# EAGLE design final_2_connectors (EAGLE 7.7.0)
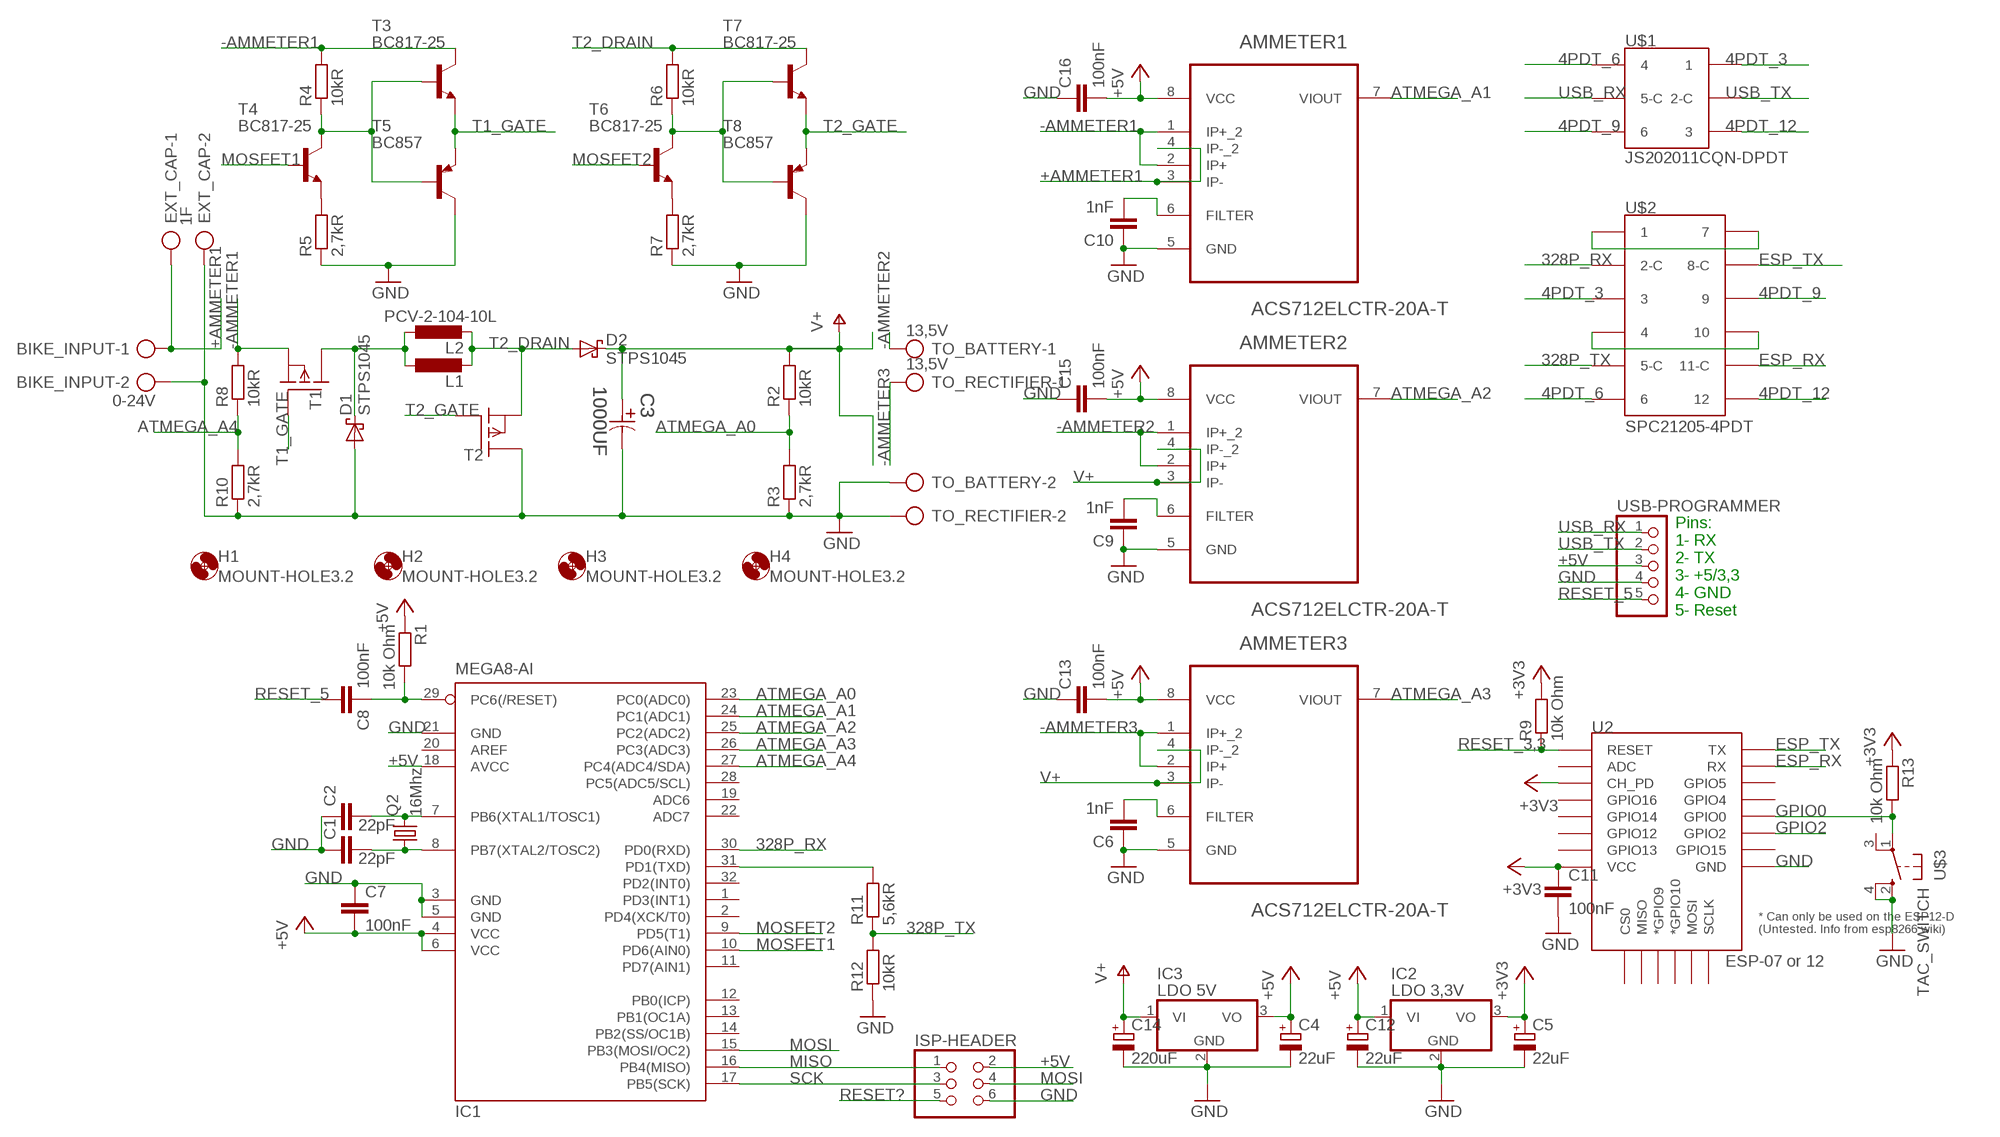
[diagram p0: schematic, sheet 1]

## Parts
AMMETER1  ACS712ELCTR-20A-T  [SOIC127P600X175-8N]
AMMETER2  ACS712ELCTR-20A-T  [SOIC127P600X175-8N]
AMMETER3  ACS712ELCTR-20A-T  [SOIC127P600X175-8N]
BIKE_INPUT  0-24V  AK500/2  [AK500/2]
C1  22pF  C-EUC0805  [C0805]
C2  22pF  C-EUC0805  [C0805]
C3  1000UF  EEV-FK1H102M-CASE-J16  [CAPAE1700X1700N]
C4  22uF  CPOL-EU153CLV-0505  [153CLV-0505]
C5  22uF  CPOL-EU153CLV-0505  [153CLV-0505]
C6  1nF  C-EUC0805  [C0805]
C7  100nF  C-EUC0805  [C0805]
C8  100nF  C-EUC0805  [C0805]
C9  1nF  C-EUC0805  [C0805]
C10  1nF  C-EUC0805  [C0805]
C11  100nF  C-EUC0805  [C0805]
C12  22uF  CPOL-EU153CLV-0505  [153CLV-0505]
C13  100nF  C-EUC0805  [C0805]
C14  220uF  CPOL-EU153CLV-0807  [153CLV-0807]
C15  100nF  C-EUC0805  [C0805]
C16  100nF  C-EUC0805  [C0805]
D1  STPS1045  [TO220AC]
D2  STPS1045  [TO220AC]
EXT_CAP  1F  AK500/2  [AK500/2]
H1  MOUNT-HOLE3.2  [3,2]
H2  MOUNT-HOLE3.2  [3,2]
H3  MOUNT-HOLE3.2  [3,2]
H4  MOUNT-HOLE3.2  [3,2]
IC1  MEGA8-AI  [TQFP32-08]
IC2  LDO 3,3V  MCP1703DB  [SOT223]
IC3  LDO 5V  MCP1703DB  [SOT223]
ISP-HEADER  PINHD-2X3  [2X03]
L1  PCV-2-104-10L  [TJ5-U2]
L2  PCV-2-104-10L  [TJ5-U2]
Q2  16Mhz  CRYSTALHC49UP  [HC49UP]
R1  10k Ohm  R-EU_M0805  [M0805]
R2  10kR  R-EU_M0805  [M0805]
R3  2,7kR  R-EU_M0805  [M0805]
R4  10kR  R-EU_M0805  [M0805]
R5  2,7kR  R-EU_M0805  [M0805]
R6  10kR  R-EU_M0805  [M0805]
R7  2,7kR  R-EU_M0805  [M0805]
R8  10kR  R-EU_M0805  [M0805]
R9  10k Ohm  R-EU_M0805  [M0805]
R10  2,7kR  R-EU_M0805  [M0805]
R11  5,6kR  R-EU_M0805  [M0805]
R12  10kR  R-EU_M0805  [M0805]
R13  10k Ohm  R-EU_M0805  [M0805]
T1  SUP65P06-20  [TO220]
T2  SUP65P06-20  [TO220]
T3  BC817-25  BC817-25-NPN-SOT23-BEC  [SOT23-BEC]
T4  BC817-25  BC817-25-NPN-SOT23-BEC  [SOT23-BEC]
T5  BC857  BC857ALT1-PNP-SOT23-BEC  [SOT23-BEC]
T6  BC817-25  BC817-25-NPN-SOT23-BEC  [SOT23-BEC]
T7  BC817-25  BC817-25-NPN-SOT23-BEC  [SOT23-BEC]
T8  BC857  BC857ALT1-PNP-SOT23-BEC  [SOT23-BEC]
TO_BATTERY  13,5V  AK500/2  [AK500/2]
TO_RECTIFIER  13,5V  AK500/2  [AK500/2]
U2  ESP-07 or 12  ESP12ESMD  [ESP12E-SMD]
U$1  JS202011CQN-DPDT  [2X3_SWITCH]
U$2  SPC21205-4PDT  [2X6_SWITCH]
U$3  TAC_SWITCH  [TL1105SP]
USB-PROGRAMMER  PINHD-1X5  [1X05]

## Nets
4PDT_3: U$1.1 U$2.3
4PDT_6: U$1.4 U$2.6
4PDT_9: U$1.6 U$2.9
4PDT_12: U$1.3 U$2.12
328P_RX: IC1.30(PD0(RXD)) U$2.2-C
328P_TX: R11.1 R12.2 U$2.5-C
+3V3: C5.+ C11.1 IC2.3(VO) R9.2 R13.1 U2.CH_PD U2.VCC
+5V: AMMETER1.8(VCC) AMMETER2.8(VCC) AMMETER3.8(VCC) C4.+ C7.2 C12.+ C13.2 C15.2 C16.2 IC1.4(VCC) IC1.6(VCC) IC1.18(AVCC) IC2.1(VI) IC3.3(VO) ISP-HEADER.2 R1.1 USB-PROGRAMMER.3
+AMMETER1: AMMETER1.3(IP-) AMMETER1.4(IP-_2) BIKE_INPUT.1 EXT_CAP.1
-AMMETER1: AMMETER1.1(IP+_2) AMMETER1.2(IP+) R4.2 R8.2 T1.3(S) T3.C
-AMMETER2: AMMETER2.1(IP+_2) AMMETER2.2(IP+) TO_BATTERY.1
-AMMETER3: AMMETER3.1(IP+_2) AMMETER3.2(IP+) TO_RECTIFIER.1
ATMEGA_A0: IC1.23(PC0(ADC0)) R2.1 R3.2
ATMEGA_A1: AMMETER1.7(VIOUT) IC1.24(PC1(ADC1))
ATMEGA_A2: AMMETER2.7(VIOUT) IC1.25(PC2(ADC2))
ATMEGA_A3: AMMETER3.7(VIOUT) IC1.26(PC3(ADC3))
ATMEGA_A4: IC1.27(PC4(ADC4/SDA)) R8.1 R10.2
ATMEGA_RESET: C8.1 IC1.29(PC6(/RESET)) R1.2
ESP_RX: U2.RXD0(RX) U$2.11-C
ESP_TX: U2.TXD0(TX) U$2.8-C
GND: AMMETER1.5(GND) AMMETER2.5(GND) AMMETER3.5(GND) BIKE_INPUT.2 C1.1 C2.1 C3.2 C4.- C5.- C6.1 C7.1 C9.1 C10.1 C11.2 C12.- C13.1 C14.- C15.1 C16.1 D1.A EXT_CAP.2 IC1.3(GND) IC1.5(GND) IC1.21(GND) IC2.2(GND) IC3.2(GND) ISP-HEADER.6 R3.1 R5.1 R7.1 R10.1 R12.1 T2.2(D) T5.C T8.C TO_BATTERY.2 TO_RECTIFIER.2 U2.GND U$3.2(S) U$3.4(S1) USB-PROGRAMMER.4
GPIO0: R13.2 U2.GPIO0 U$3.1(P)
GPIO2: U2.GPIO2
MISO: IC1.16(PB4(MISO)) ISP-HEADER.1
MOSFET1: IC1.10(PD6(AIN0)) T4.B
MOSFET2: IC1.9(PD5(T1)) T6.B
MOSI: IC1.15(PB3(MOSI/OC2)) ISP-HEADER.4
N$2: IC1.31(PD1(TXD)) R11.2
N$3: U$2.4 U$2.10
N$4: U$2.1 U$2.7
N$7: R7.2 T6.E
N$8: D1.C L1.1 L2.1 T1.2(D)
N$10: R5.2 T4.E
N$14: R6.1 T6.C T7.B T8.B
N$15: R4.1 T3.B T4.C T5.B
N$17: AMMETER3.6(FILTER) C6.2
N$19: AMMETER2.6(FILTER) C9.2
N$21: AMMETER1.6(FILTER) C10.2
QUARZ_N: C1.2 IC1.8(PB7(XTAL2/TOSC2)) Q2.1
QUARZ_P: C2.2 IC1.7(PB6(XTAL1/TOSC1)) Q2.2
RESET?: ISP-HEADER.5
RESET_3,3: R9.1 U2.RESET
RESET_5: C8.2 USB-PROGRAMMER.5
SCK: IC1.17(PB5(SCK)) ISP-HEADER.3
T1_GATE: T1.1(G) T3.E T5.E
T2_DRAIN: D2.A L1.2 L2.2 R6.2 T2.3(S) T7.C
T2_GATE: T2.1(G) T7.E T8.E
USB_RX: U$1.5-C USB-PROGRAMMER.1
USB_TX: U$1.2-C USB-PROGRAMMER.2
V+: AMMETER2.3(IP-) AMMETER2.4(IP-_2) AMMETER3.3(IP-) AMMETER3.4(IP-_2) C3.1 C14.+ D2.C IC3.1(VI) R2.2
Unconnected: IC1.1(PD3(INT1)) IC1.2(PD4(XCK/T0)) IC1.11(PD7(AIN1)) IC1.12(PB0(ICP)) IC1.13(PB1(OC1A)) IC1.14(PB2(SS/OC1B)) IC1.19(ADC6) IC1.20(AREF) IC1.22(ADC7) IC1.28(PC5(ADC5/SCL)) IC1.32(PD2(INT0)) U2.ADC U2.CS0 U2.GPIO4 U2.GPIO5 U2.GPIO9(*GPIO9) U2.GPIO10(*GPIO10) U2.GPIO12 U2.GPIO13 U2.GPIO14 U2.GPIO15 U2.GPIO16 U2.MISO U2.MOSI U2.SCLK U$3.3(P1)

## Notes on the sheet
- Pins:
  1- RX
  2- TX
  3- +5/3,3
  4- GND
  5- Reset

## Library data of the parts
AMMETER1-AMMETER3 = ACS712-20A_Farnell:ACS712ELCTR-20A-T: Linear Current Sensor; MPN: ACS712ELCTR-20A-T; OC_FARNELL: 1329624; OC_NEWARK: 31M3133; PACKAGE: SOIC-8; SUPPLIER: Allegro
BIKE_INPUT EXT_CAP TO_BATTERY TO_RECTIFIER = con-ptr500:AK500/2: CONNECTOR; OC_FARNELL: unknown; OC_NEWARK: unknown
C1 C2 C6-C11 C13 C15 C16 = rcl:C-EU: CAPACITOR, European symbol
C3 = Panasonic-EEE-EEV-EEF-ECQ:EEV-: Aluminum Electrolytic Capacitors,Surface Mount Type; MPN: EEVFK1H102M; OC_FARNELL: 9695982; OC_NEWARK: 96K9480; SUPPLIER: PANASONIC; TOLERANCE: ±20 %; VOLTAGERATING: 50V
C4 C5 C12 C14 = rcl:CPOL-EU: POLARIZED CAPACITOR, European symbol
D1 D2 = stps1045_own:STPS1045: DIODE barrier rectifier, 7.5 A, 50 V
H1-H4 = holes:MOUNT-HOLE: MOUNTING HOLE with drill center marker
IC1 = atmel:MEGA8: MICROCONTROLLER 8 Kbytes FLASH, 1 kbytes SRAM, 512 bytes EEPROM, USART, 6-channel 10 bit ADC, 2-channel 8 bit ADC Pin compatible with Atmega48, ATMega88, ATMega168 Source: avr.lbr; MPN: ATMEGA8-16AU; OC_FARNELL: 9171371; OC_NEWARK: 73M8863
IC2 IC3 = linear:MCP1703: 250 mA, 16V, Low Quiescent Current LDO Regulator Source: http://ww1.microchip.com/downloads/en/DeviceDoc/22049b.pdf
ISP-HEADER = pinhead:PINHD-2X3: PIN HEADER
L1 L2 = Library_TW:PCV-2-104-10L
Q2 = crystal:CRYSTAL: CRYSTAL; OC_FARNELL: unknown; OC_NEWARK: unknown
R1-R13 = rcl:R-EU_: RESISTOR, European symbol
T1 T2 = transistor-fet:SUP65P06-20: P-Channel Enhancement MOSFET -60V; 60A; 0,020Ohm
T3 T4 T6 T7 = transistor:*-NPN-: NPN Transistror BF959 corrected 2008.03.06
T5 T8 = transistor:*-PNP-: PNP Transistror
U2 = esp8266modules:ESP12E: ESP12E Module
U$1 = Library_TW:JS202011CQN-DPDT
U$2 = Library_TW:SPC21205-4PDT
U$3 = Library_TW:TAC_SWITCH
USB-PROGRAMMER = pinhead:PINHD-1X5: PIN HEADER

## Board
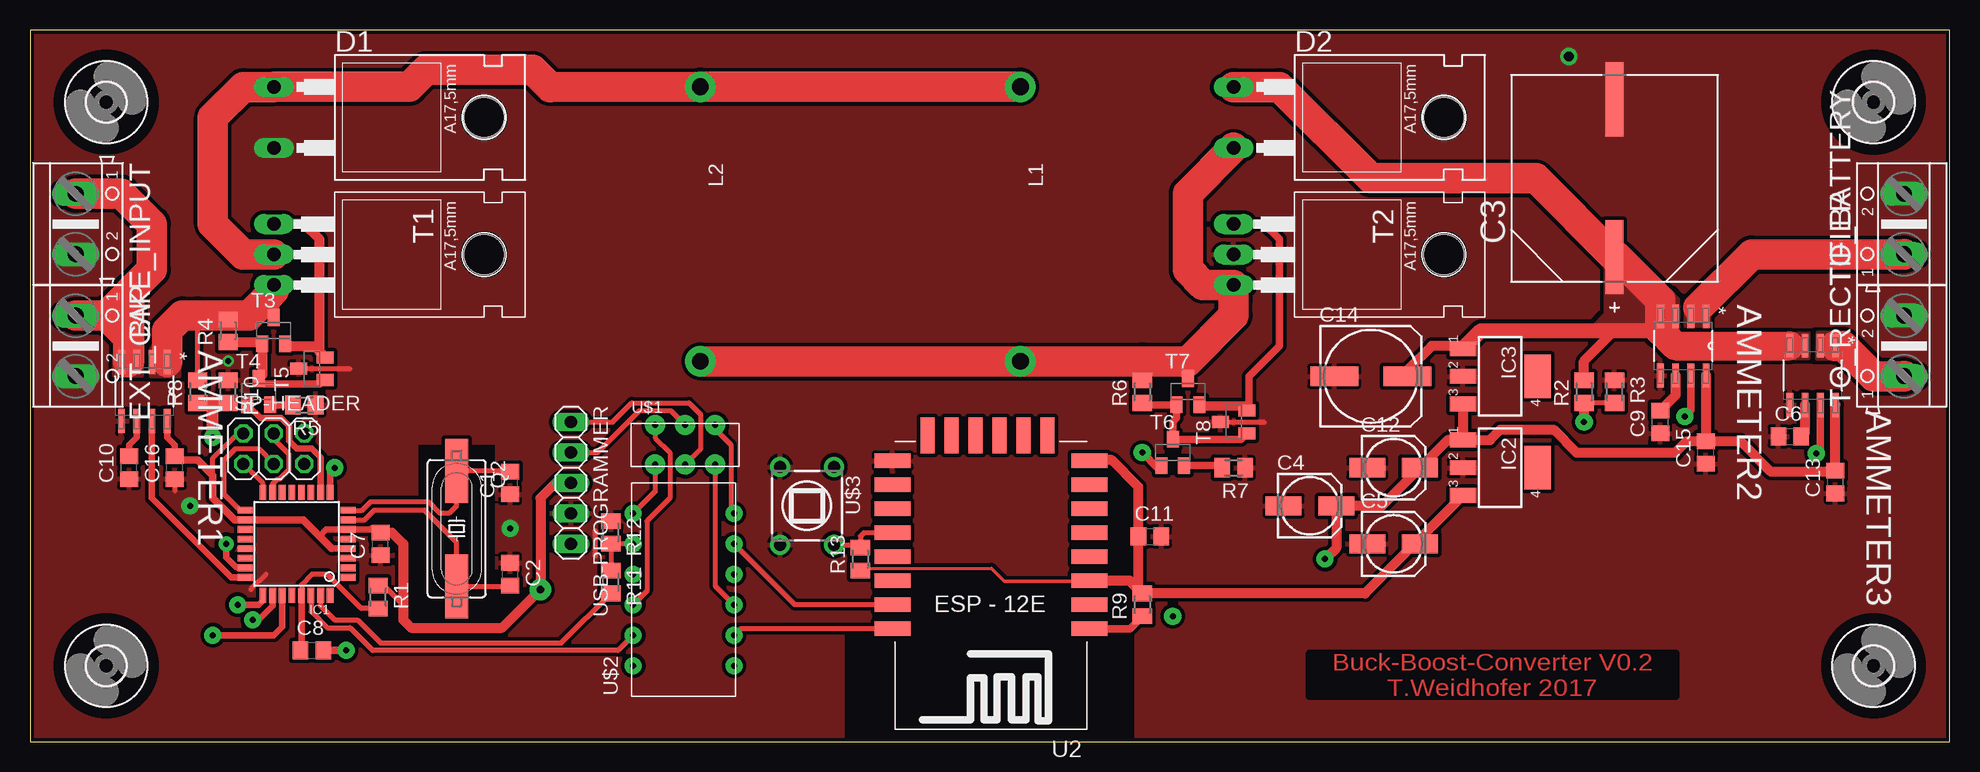
[diagram p1: board, top side]
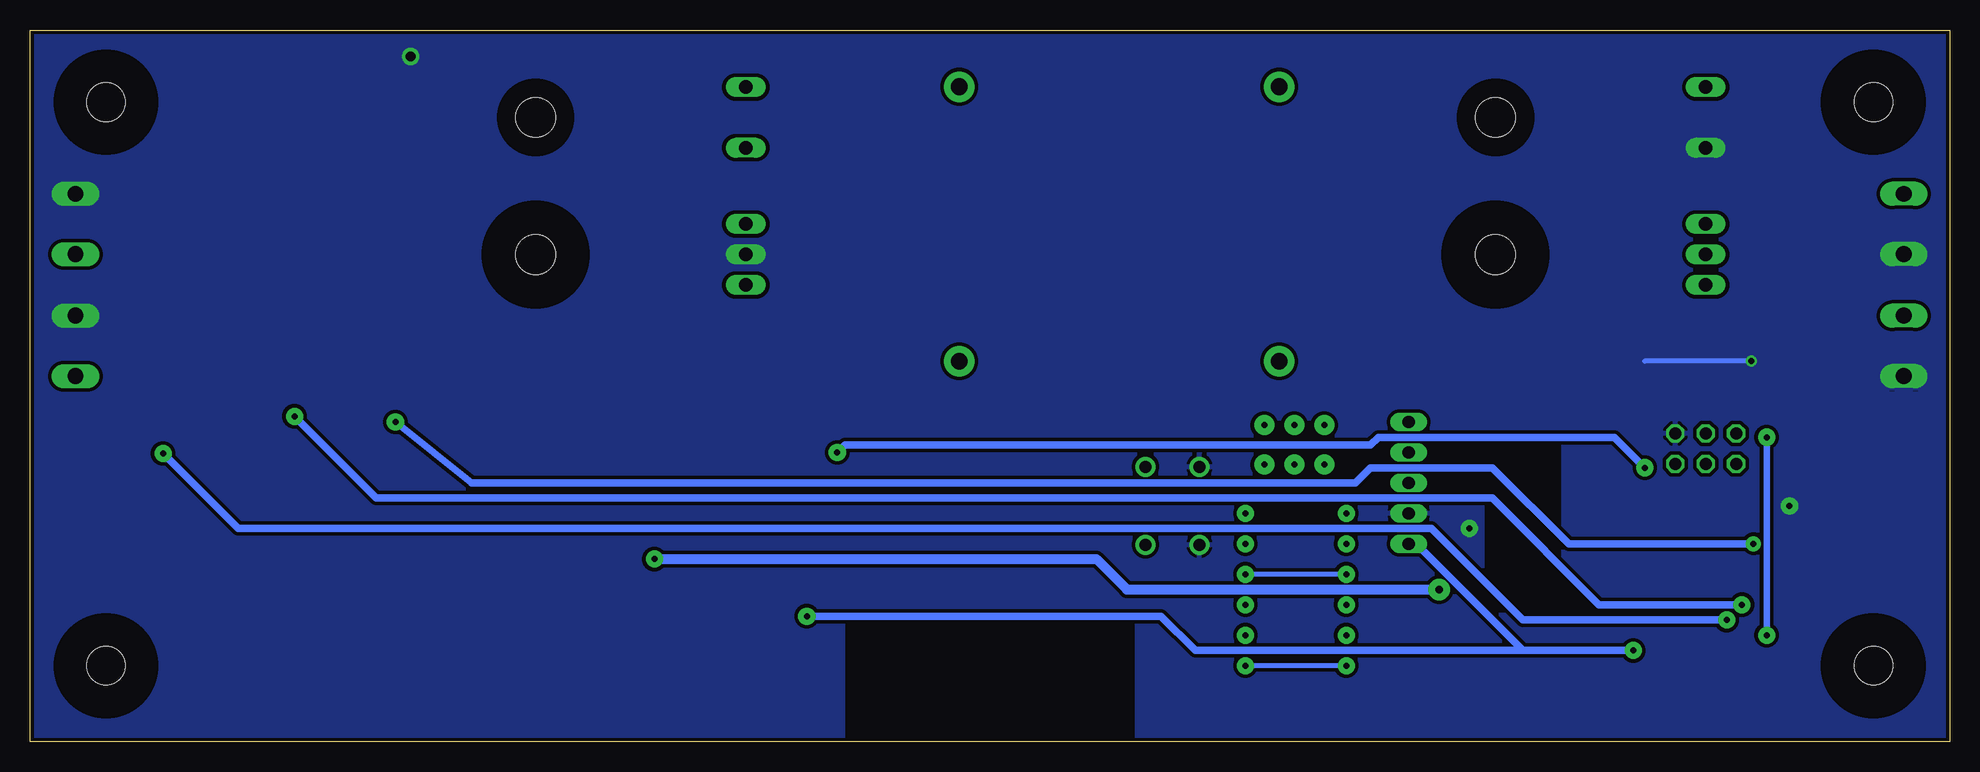
[diagram p2: board, bottom side, seen from below]

Size 160 x 59.36 mm. Coordinates in mm from the lower left corner, seen from the top.
Outline: 0,0 160,0 160,59.36 0,59.36 0,0
Copper layers (1*16): Top 0.035mm / dielectric 1.5mm / Bottom 0.035mm
Design rules "pcb_pool *": minimum track width 10mil, minimum drill 12mil, track to track 6mil, track to pad 6mil, pad to pad 6mil, via to via 6mil, smd to smd 6mil, copper to edge 0.00025mm, drill to drill 8mil, minimum pad ring 10mil, minimum via ring 8mil, stop-mask expansion 4mil, vias tented up to drill 0mil, thermal gap 10mil

### Footprints (pad centres in the part's own frame; a part is rotated, then mirrored left to right if it is on the bottom)
SOIC127P600X175-8N = smd 1.981 x 0.559: 1 -2.464,1.905; 2 -2.464,0.635; 3 -2.464,-0.635; 4 -2.464,-1.905; 5 2.464,-1.905; 6 2.464,-0.635; 7 2.464,0.635; 8 2.464,1.905
AK500/2 = drill 1.321 long: 1 -2.515,0; 2 2.515,0
C0805 = smd 1.3 x 1.5: 1 -0.95,0; 2 0.95,0
CAPAE1700X1700N = smd 6.172 x 1.499: 1 -6.579,0; 2 6.579,0
153CLV-0505 = smd 3 x 1.6: + 2.2,0; - -2.2,0
153CLV-0807 = smd 4 x 1.6: + 3.05,0; - -3.05,0
TO220AC = drill 1.118 long: A 2.54,-6.35; C -2.54,-6.35 | hole 3.302: 0,11.176
3,2 = hole 3.2: 0,0
TQFP32-08 = smd 1.27 x 0.559: 1 -4.293,2.8; 2 -4.293,2; 3 -4.293,1.2; 4 -4.293,0.4; 5 -4.293,-0.4; 6 -4.293,-1.2; 7 -4.293,-2; 8 -4.293,-2.8; 17 4.293,-2.8; 18 4.293,-2; 19 4.293,-1.2; 20 4.293,-0.4; 21 4.293,0.4; 22 4.293,1.2; 23 4.293,2; 24 4.293,2.8 | smd 0.559 x 1.27: 9 -2.8,-4.293; 10 -2,-4.293; 11 -1.2,-4.293; 12 -0.4,-4.293; 13 0.4,-4.293; 14 1.2,-4.293; 15 2,-4.293; 16 2.8,-4.293; 25 2.8,4.293; 26 2,4.293; 27 1.2,4.293; 28 0.4,4.293; 29 -0.4,4.293; 30 -1.2,4.293; 31 -2,4.293; 32 -2.8,4.293
SOT223 = smd 1.219 x 2.235: 1 -2.311,-3.099; 2 0,-3.099; 3 2.311,-3.099 | smd 3.6 x 2.2: 4 0,3.099
2X03 = drill 1.016 octagon: 1 -2.54,-1.27; 2 -2.54,1.27; 3 0,-1.27; 4 0,1.27; 5 2.54,-1.27; 6 2.54,1.27
TJ5-U2 = drill 1.4 pad 2.54: 1 -11.45,0; 2 11.45,0
HC49UP = smd 5.334 x 1.93: 1 -4.826,0; 2 4.826,0
M0805 = smd 1.3 x 1.6: 1 -0.95,0; 2 0.95,0
TO220 = drill 1.118 long: 1 -2.54,-6.35; 2 0,-6.35; 3 2.54,-6.35 | hole 3.302: 0,11.176
SOT23-BEC = smd 1 x 1.4: B -0.95,-1.1; C 0,1.1; E 0.95,-1.1
ESP12E-SMD = smd 3 x 1.2: ADC -8.3,3.8; CH_PD -8.3,1.8; GND 8.1,-8.2; GPIO0 8.1,-2.2; GPIO2 8.1,-4.2; GPIO4 8.1,-0.2; GPIO5 8.1,1.8; GPIO12 -8.3,-4.2; GPIO13 -8.3,-6.2; GPIO14 -8.3,-2.2; GPIO15 8.1,-6.2; GPIO16 -8.3,-0.2; RESET -8.3,5.8; RXD0 8.1,3.8; TXD0 8.1,5.8; VCC -8.3,-8.2 | smd 1.2 x 3: CS0 -4.8,-10.3; GPIO9 -0.8,-10.3; GPIO10 1.2,-10.3; MISO -2.8,-10.3; MOSI 3.2,-10.3; SCLK 5.2,-10.3
2X3_SWITCH = drill 0.5 pad 1.676: 1 -2.5,1.65; 2-C 0,1.65; 3 2.5,1.65; 4 -2.5,-1.65; 5-C 0,-1.65; 6 2.5,-1.65
2X6_SWITCH = drill 0.5 pad 1.422: 1 -6.35,4.325; 2-C -3.81,4.325; 3 -1.27,4.325; 4 1.27,4.325; 5-C 3.81,4.325; 6 6.35,4.325; 7 -6.35,-4.075; 8-C -3.81,-4.075; 9 -1.27,-4.075; 10 1.27,-4.075; 11-C 3.81,-4.075; 12 6.35,-4.075
TL1105SP = drill 1 pad 1.676: 1 3.25,2.25; 2 3.25,-2.25; 3 -3.25,2.25; 4 -3.25,-2.25
1X05 = drill 1.016 long: 1 -5.08,0; 2 -2.54,0; 3 0,0; 4 2.54,0; 5 5.08,0

### Placement (x,y rotation side)
AMMETER1  9.53,29.21 270 top
AMMETER2  137.79,33.02 270 top
AMMETER3  148.59,30.56 270 top
BIKE_INPUT  3.81,43.18 270 top
C1  40.01,21.59 90 top
C2  40.01,13.97 270 top
C3  132.08,46.99 90 top
C4  106.68,19.68 0 top
C5  113.67,16.51 0 top
C6  146.69,25.48 0 top
C7  29.21,16.51 90 top
C8  23.5,7.62 0 top
C9  135.89,26.67 90 top
C10  8.26,22.86 90 top
C11  93.34,17.14 0 top
C12  113.67,22.86 0 top
C13  150.5,21.67 90 top
C14  111.76,30.48 0 top
C15  139.7,24.13 90 top
C16  12.06,22.86 90 top
D1  26.67,52.07 270 top
D2  106.68,52.07 270 top
EXT_CAP  3.81,33.02 270 top
H1  6.35,6.35 0 top
H2  153.67,6.35 0 top
H3  6.35,53.34 0 top
H4  153.67,53.34 0 top
IC1  22.23,16.51 180 top
IC2  122.56,22.86 270 top
IC3  122.56,30.48 270 top
ISP-HEADER  20.32,24.45 0 top
L1  82.55,43.18 270 top
L2  55.88,43.18 270 top
Q2  35.56,17.78 270 top
R1  29.02,12.06 270 top
R2  129.54,29.21 90 top
R3  132.08,29.21 270 top
R4  16.51,34.29 90 top
R5  22.86,28.1 180 top
R6  92.71,29.21 90 top
R7  100.33,22.86 180 top
R8  13.97,29.21 90 top
R9  92.71,11.43 90 top
R10  16.51,29.21 270 top
R11  48.42,13.34 270 top
R12  48.42,17.46 270 top
R13  69.22,15.24 90 top
T1  26.67,40.64 270 top
T2  106.68,40.64 270 top
T3  20.32,34.29 0 top
T4  19.05,29.21 0 top
T5  23.5,31.11 90 top
T6  95.25,24.13 0 top
T7  96.52,29.21 0 top
T8  100.33,26.67 90 top
TO_BATTERY  156.21,43.18 90 top
TO_RECTIFIER  156.21,33.02 90 top
U2  80.01,15.24 180 top
U$1  54.61,24.77 0 top
U$2  54.61,12.7 90 top
U$3  64.77,19.68 270 top
USB-PROGRAMMER  45.09,21.59 270 top

### Tracks (layer width: path | path; a pad name or v marks a point on that pad's centre or on a via)
4PDT_3
  Top 0.406: U$1.1 52.11,25.36 53.34,24.13 53.34,20.32 51.44,18.41 51.44,12.58 U$2.3
4PDT_6
  Top 0.406: U$1.4 52.11,20.88 U$2.6
4PDT_9
  Top 0.406: U$1.6 57.11,13.01 U$2.9
4PDT_12
  Top 0.406: U$1.3 57.11,26.07 58.42,24.77 58.42,19.32 U$2.12
328P_RX
  Top 0.406: IC1.30 23.43,10.87 24.77,9.53 26.67,9.53 28.57,7.62 49.02,7.62 U$2.2-C
328P_TX
  Top 0.406: R11.1 R12.2 U$2.5-C
+3V3
  Top 0.254: 69.4,14.48 80.14,14.48
  Top 0.305: 69.34,14.41 R13.1 69.4,14.48 | 80.14,14.48 81.22,13.4 88.8,13.4 88.84,13.44
  Top 0.813: IC2.3 115.86,16.96 | 115.86,16.96 C5.+ | 115.86,16.96 111.29,12.38 R9.2 | R9.2 92.39,12.7 C11.1 92.39,21.27 90.17,23.5 88.36,23.5 U2.VCC | R9.2 91.65,13.44 88.84,13.44 U2.CH_PD
+5V  (via drill 0.5 pad 1.42, 0.6 pad 1.78)
  Top 0.406: C7.2 28.57,17.65 28.51,17.72 | R1.1 29.53,13.02 31.11,11.43 | 15.24,22.23 15.24,23.65 17.3,25.72 ISP-HEADER.2
  Top 0.559: 28.51,17.72 IC1.6 24.7,17.71 24.13,17.14 | 25.15,16.13 26.5,16.13 IC1.4 | AMMETER1.8 11.43,25.4 12.06,24.77 C16.2
  Top 0.61: C7.2 28.57,17.78 | 25.15,16.13 24.13,17.14 22.77,18.51 IC1.18 17.05,18.51 15.24,20.32 15.24,22.23 13.97,23.5 12.38,23.5 C16.2
  Top 0.813: C15.2 AMMETER2.8 139.7,25.2 139.75,25.15 | C13.2 150.5,22.71 | 150.5,22.71 AMMETER3.8 | IC3.3 IC2.1 | IC2.1 118.18,25.17 C12.+ 112.69,19.68 C4.+ 108.88,16.17 v107.95,15.24 | C15.2 138.11,25.08 137.16,24.13 128.91,24.13 127,26.04 122.56,26.04 121.69,25.17 IC2.1 | C7.2 30.16,17.46 31.11,16.51 31.11,11.43 31.11,10.16 31.75,9.53 39.37,9.53 v42.55,12.7 42.55,20.32 43.81,21.59 USB-PROGRAMMER.3 | 150.5,22.71 150.49,22.7 150.49,22.53 150.5,22.52 145.12,22.52 142.56,25.08 C15.2
  Bottom 0.813: v107.95,15.24 71.12,15.24 68.58,12.7 v42.55,12.7
+AMMETER1
  Top 0.254: 8.18,31.67 8.26,31.75 8.81,31.75 AMMETER1.3
  Top 1.27: 8.18,31.67 AMMETER1.4
  Top 2.54: BIKE_INPUT.1 5.8,45.72 7.62,45.72 10.16,43.18 10.16,39.37 6.35,35.56 | EXT_CAP.1 6.33,35.53 6.35,35.56 | 8.18,31.67 8.18,33.73 6.35,35.56 | 8.26,31.75 8.26,37.31
  pour Top (isolate 0.305, no thermals): 9.37,30.48 6.99,30.48 6.99,32.07 9.21,32.07 9.37,31.75
-AMMETER1
  Top 0.406: R8.2 13.97,35.56 16.19,35.56 R4.2 | AMMETER1.2 AMMETER1.1 | T3.C 20.32,35.56 | 20.32,37.47 20.32,37.62 T1.3
  Top 1.016: 20.32,35.56 20.32,36.83 19.92,37.23
  Top 2.54: AMMETER1.1 11.43,34.29 12.7,35.56 13.97,35.56 18.26,35.56 19.92,37.23 20.32,37.62
  pour Top (no thermals): 10,30.48 12.54,30.48 12.54,33.18 10.32,33.18 10,32.7
-AMMETER2
  Top 0.61: AMMETER2.2 139.06,35.48 AMMETER2.1
  Top 1.016: 139.06,35.48 139.06,36.2
  Top 2.54: 139.06,36.2 143.51,40.64 156.19,40.64 TO_BATTERY.1
  pour Top (isolate 0.305, rank 2, no thermals): 137.79,36.2 137.79,34.45 140.02,34.45 140.02,36.2
-AMMETER3
  Top 0.61: AMMETER3.2 AMMETER3.1
  Top 2.54: 156.19,30.5 TO_RECTIFIER.1 156.19,30.48 153.67,30.48 151.13,33.02 AMMETER3.1
  pour Top (no thermals): 150.5,34.16 150.5,31.87 148.96,31.87 148.97,34.16
ATMEGA_A0  (via drill 0.5 pad 1.27, 0.5 pad 1.42)
  Top 0.406: R3.2 R2.1
  Top 0.508: IC1.23 17.24,14.51 16.35,15.4
  Top 0.533: 16.35,15.4 v16.35,16.51
  Top 0.813: R2.1 v129.54,26.67
  Bottom 0.61: v16.35,16.51 31.75,16.51 38.1,22.86 48.26,22.86 49.53,21.59 123.19,21.59 v129.54,26.67
ATMEGA_A1
  Top 0.533: 16.76,13.72 IC1.24
  Top 0.559: AMMETER1.7 10.16,20.32 16.76,13.72 | IC1.24
ATMEGA_A2  (via drill 0.5 pad 1.42)
  Top 0.406: IC1.25 19.43,11.8
  Top 0.559: 19.43,11.8 19.05,11.43 v17.3,11.43
  Top 0.61: AMMETER2.7 138.43,27.62 v137.95,27.15
  Bottom 0.61: v17.3,11.43 29.21,11.43 38.1,20.32 131.13,20.32 v137.95,27.15
ATMEGA_A3  (via drill 0.5 pad 1.42)
  Top 0.559: IC1.26 20.23,11.34 19.05,10.16 v18.57,10.16
  Top 0.61: AMMETER3.7 149.22,24.36 v148.91,24.05
  Bottom 0.61: v18.57,10.16 35.56,10.16 43.18,17.78 142.64,17.78 v148.91,24.05
ATMEGA_A4  (via drill 0.5 pad 1.42)
  Top 0.406: R8.1 15.24,28.26 R10.2
  Top 0.559: IC1.27 21.02,9.6 20.32,8.89 v15.24,8.89
  Top 1.016: v15.24,25.4 15.24,28.26
  Bottom 0.559: v15.24,8.89 v15.24,25.4
  pour Top (no thermals): 14.76,28.91 15.78,28.91 15.78,28.26 14.68,28.26 14.68,28.32 14.68,28.91
ATMEGA_RESET
  Top 0.406: R1.2 27.62,11.12 24.77,13.97 23.5,13.97 22.62,13.1 IC1.29
  Top 0.559: IC1.29 22.62,7.7 C8.1
ESP_RX
  Top 0.406: U2.RXD0 63.76,11.44 U$2.11-C
ESP_TX
  Top 0.406: U2.TXD0 59.23,9.44 U$2.8-C
GND  (via drill 0.5, 0.5 pad 1.42, 0.8 pad 1.42)
  Top 0.406: 19.68,13.97 18.41,12.7 | C16.1 12.06,20.95 | T8.C 102.87,26.67 | T5.C 26.67,31.11 | 47.12,17.59 47.12,15.49
  Bottom 0.406: v16.51,31.75 25.4,31.75
  other vias: 13.34,19.68 40.01,17.78 128.27,57.15
  pour Top (isolate 0.305, rank 3): 0,0 160.02,0 160.02,59.69 0,59.69
  pour Bottom (isolate 0.305): 0,59.69 160.02,59.69 160.02,0 0,0
  cutout Bottom: 92.01,0 92.01,9.91 67.94,9.91 67.94,0
  cutout Top: 67.94,9.91 92.01,9.91 92.01,0 67.94,0
  cutout Bottom: 32.38,24.77 38.73,24.77 38.73,10.79 32.38,10.79
  cutout Top: 32.38,10.79 32.38,24.77 38.73,24.77 38.73,10.79
  pour Bottom (no thermals): 158.94,37.53 158.94,33.72 153.54,33.78 153.54,37.59
  pour Top (isolate 0.305, no thermals): 158.94,33.78 158.94,37.4 153.54,37.4 153.54,33.78
  pour Top (no thermals): 158.88,44.01 158.88,47.5 153.54,47.5 153.54,44.01
  pour Bottom (no thermals): 158.88,47.69 158.88,43.88 153.54,44.01 153.54,47.82
  pour Top (no thermals): 17.78,50.8 22.86,50.8 22.86,48.26 17.78,48.26
  pour Bottom (no thermals): 17.78,50.8 22.86,50.8 22.86,48.26 17.78,48.26
  pour Bottom (no thermals): 1.3,31.85 6.35,31.83 6.35,29.29 1.3,29.31
  pour Top (no thermals): 1.3,31.97 6.35,31.97 6.35,29.05 1.3,29.05
  pour Bottom (no thermals): 97.79,41.91 102.87,41.91 102.87,39.37 97.79,39.37
  pour Top (no thermals): 130.81,57.15 133.35,57.15 133.35,49.53 130.81,49.53
  pour Bottom (no thermals): 0.95,42.1 7.37,42.1 8.19,41.27 8.19,40.13 7.11,39.05 3.87,39.05 0.89,39.5 0.89,42.04
  pour Top (no thermals): 0.95,42.1 7.37,42.1 8.19,41.27 8.19,40.13 7.11,39.05 3.87,39.05 0.89,39.5 0.89,42.04
GPIO0
  Top 0.406: U$3.1 68.97,16.43 R13.2 69.22,17.14 69.51,17.44 U2.GPIO0
MISO
  Top 0.406: IC1.16 19.43,21.53 ISP-HEADER.1
MOSFET1
  Top 0.559: IC1.10 24.23,23.72 23.5,24.45 22.23,24.45 21.59,25.08 21.59,26.35 20.95,26.99 19.22,26.99 T4.B
MOSFET2  (via drill 0.5 pad 1.42)
  Top 0.559: IC1.9 25.02,22.48 v25.4,22.86
  Top 0.61: v92.71,24.13 93.98,22.86 94.13,22.86 T6.B
  Bottom 0.61: v25.4,22.86 27.94,25.4 47.62,25.4 48.26,24.77 92.08,24.77 v92.71,24.13
MOSI
  Top 0.406: IC1.15 20.23,21.5 20.64,21.91 20.8,21.91 21.59,22.7 21.59,23.97 20.32,25.24 ISP-HEADER.4
N$2
  Top 0.406: IC1.31 24.23,11.34 25.4,10.16 27.3,10.16 29.21,8.26 44.29,8.26 R11.2
N$3
  Bottom 0.406: U$2.4 U$2.10
N$4
  Bottom 0.406: U$2.1 U$2.7
N$7
  Top 0.61: T6.E 99.21,23.03 R7.2
N$8
  Top 2.54: T1.2 17.78,40.64 15.24,43.18 15.24,52.07 17.78,54.61 D1.C 20.34,54.63 31.61,54.63 33.02,56.04 41.91,56.04 43.34,54.61 L2.1 L1.1
N$10
  Top 0.61: T4.E 20.15,28.11 20.16,28.1 R5.2
N$14
  Top 0.61: R6.1 92.86,28.11 T7.B 95.57,26.99 95.25,26.67 T6.C 100.94,25.23 T8.B
N$15
  Top 0.61: T5.B 24.45,30.16 24.13,29.84 19.52,29.84 T4.C
  Top 0.813: R4.1 19.22,33.34 T3.B 19.37,30.63 T4.C
N$17
  Top 0.813: AMMETER3.6 147.96,25.8 C6.2
N$19
  Top 0.813: AMMETER2.6 137.16,28.89 C9.2
N$21
  Top 0.559: AMMETER1.6 8.89,25.4 8.26,24.77 C10.2
QUARZ_N
  Top 0.406: IC1.8 27.68,19.31 27.69,19.3 28.43,20.04 33.17,20.04 34.16,19.05 34.92,19.05 35.56,19.68 Q2.1 40.57,22.61 C1.2
QUARZ_P
  Top 0.406: IC1.7 27.9,18.51 28.72,19.33 32.87,19.33 35.56,16.64 Q2.2 40.57,12.95 C2.2
RESET_3,3
  Top 0.61: R9.1 91.67,9.44 U2.RESET
RESET_5  (via drill 0.5 pad 1.42)
  Top 0.61: C8.2 v26.35,7.62
  Bottom 0.61: v26.35,7.62 35.56,7.62 | 35.56,7.62 62.87,7.62 65.72,10.48 v95.25,10.48 | USB-PROGRAMMER.5 44.45,16.51 35.56,7.62
SCK
  Top 0.406: IC1.17 17.52,19.31 16.19,20.64 16.19,23.5 17.14,24.45 19.05,24.45 ISP-HEADER.3
T1_GATE
  Top 0.813: T5.E 24.13,32.53 24.13,33.02 | 24.13,33.02 24.13,41.91 22.86,43.18 T1.1 | T3.E 21.44,33.02 24.13,33.02
T2_DRAIN
  Top 0.61: 100.33,37.47 T2.3 | R6.2 92.71,31.73 | T7.C 96.52,31.71 96.5,31.73
  Top 2.54: L2.2 L1.2 92.71,31.73 96.5,31.73 100.33,35.56 T2.3 97.79,38.1 96.52,39.37 96.52,45.72 D2.A | 100.33,36.83 100.33,37.47
T2_GATE
  Top 0.61: T8.E 101.43,27.77 101.6,27.94 | 101.6,27.94 97.64,27.94 T7.E 101.43,28.11 101.6,27.94 | 101.6,27.94 101.6,30.48 104.14,33.02 104.14,41.91 102.87,43.18 T2.1
USB_RX
  Top 0.406: USB-PROGRAMMER.1 48.58,26.67 50.16,28.26 54.93,28.26 55.88,27.3 55.88,24.39 U$1.5-C
USB_TX
  Top 0.406: USB-PROGRAMMER.2 47.31,24.13 50.8,27.62 53.4,27.62 U$1.2-C
V+
  Top 0.254: AMMETER2.4 AMMETER2.3
  Top 0.406: AMMETER3.3 AMMETER3.4
  Top 0.813: IC3.1 119.23,33.02 116.84,33.02 114.81,30.99 C14.+ | R2.2 129.54,31.75 132.08,34.29
  Top 1.27: IC3.1 120.95,34.29 132.08,34.29 135.89,34.29
  Top 2.413: 135.89,34.29 137.16,33.02 AMMETER3.4
  Top 2.54: D2.C 104.14,54.61 111.76,46.99 125.5,46.99 C3.1 132.31,40.41 135.89,36.83 AMMETER2.4 135.89,34.29
  pour Top (no thermals): 148.27,34.1 148.27,31.94 146.73,31.94 146.75,34.1
  pour Top (no thermals): 137.48,36.91 137.48,34.29 136.84,34.29 136.72,37.7
  pour Top (no thermals): 131.29,40.01 131.29,35.72 130.18,34.61 134.78,34.61 135.25,35.08 135.25,36.04

### Text on the board
Top: Buck-Boost-Converter V0.2 / T.Weidhofer 2017